# Altium schematic sheet Segway_Charging_Board_SheetName.SchDoc: Segway Charging Board
size A3; ENG_APP_DATE: --/--/--; DSN_APP_DATE: --/--/--; CHK_APP_DATE: --/--/--; SheetNumber: 1; SheetTotal: 3
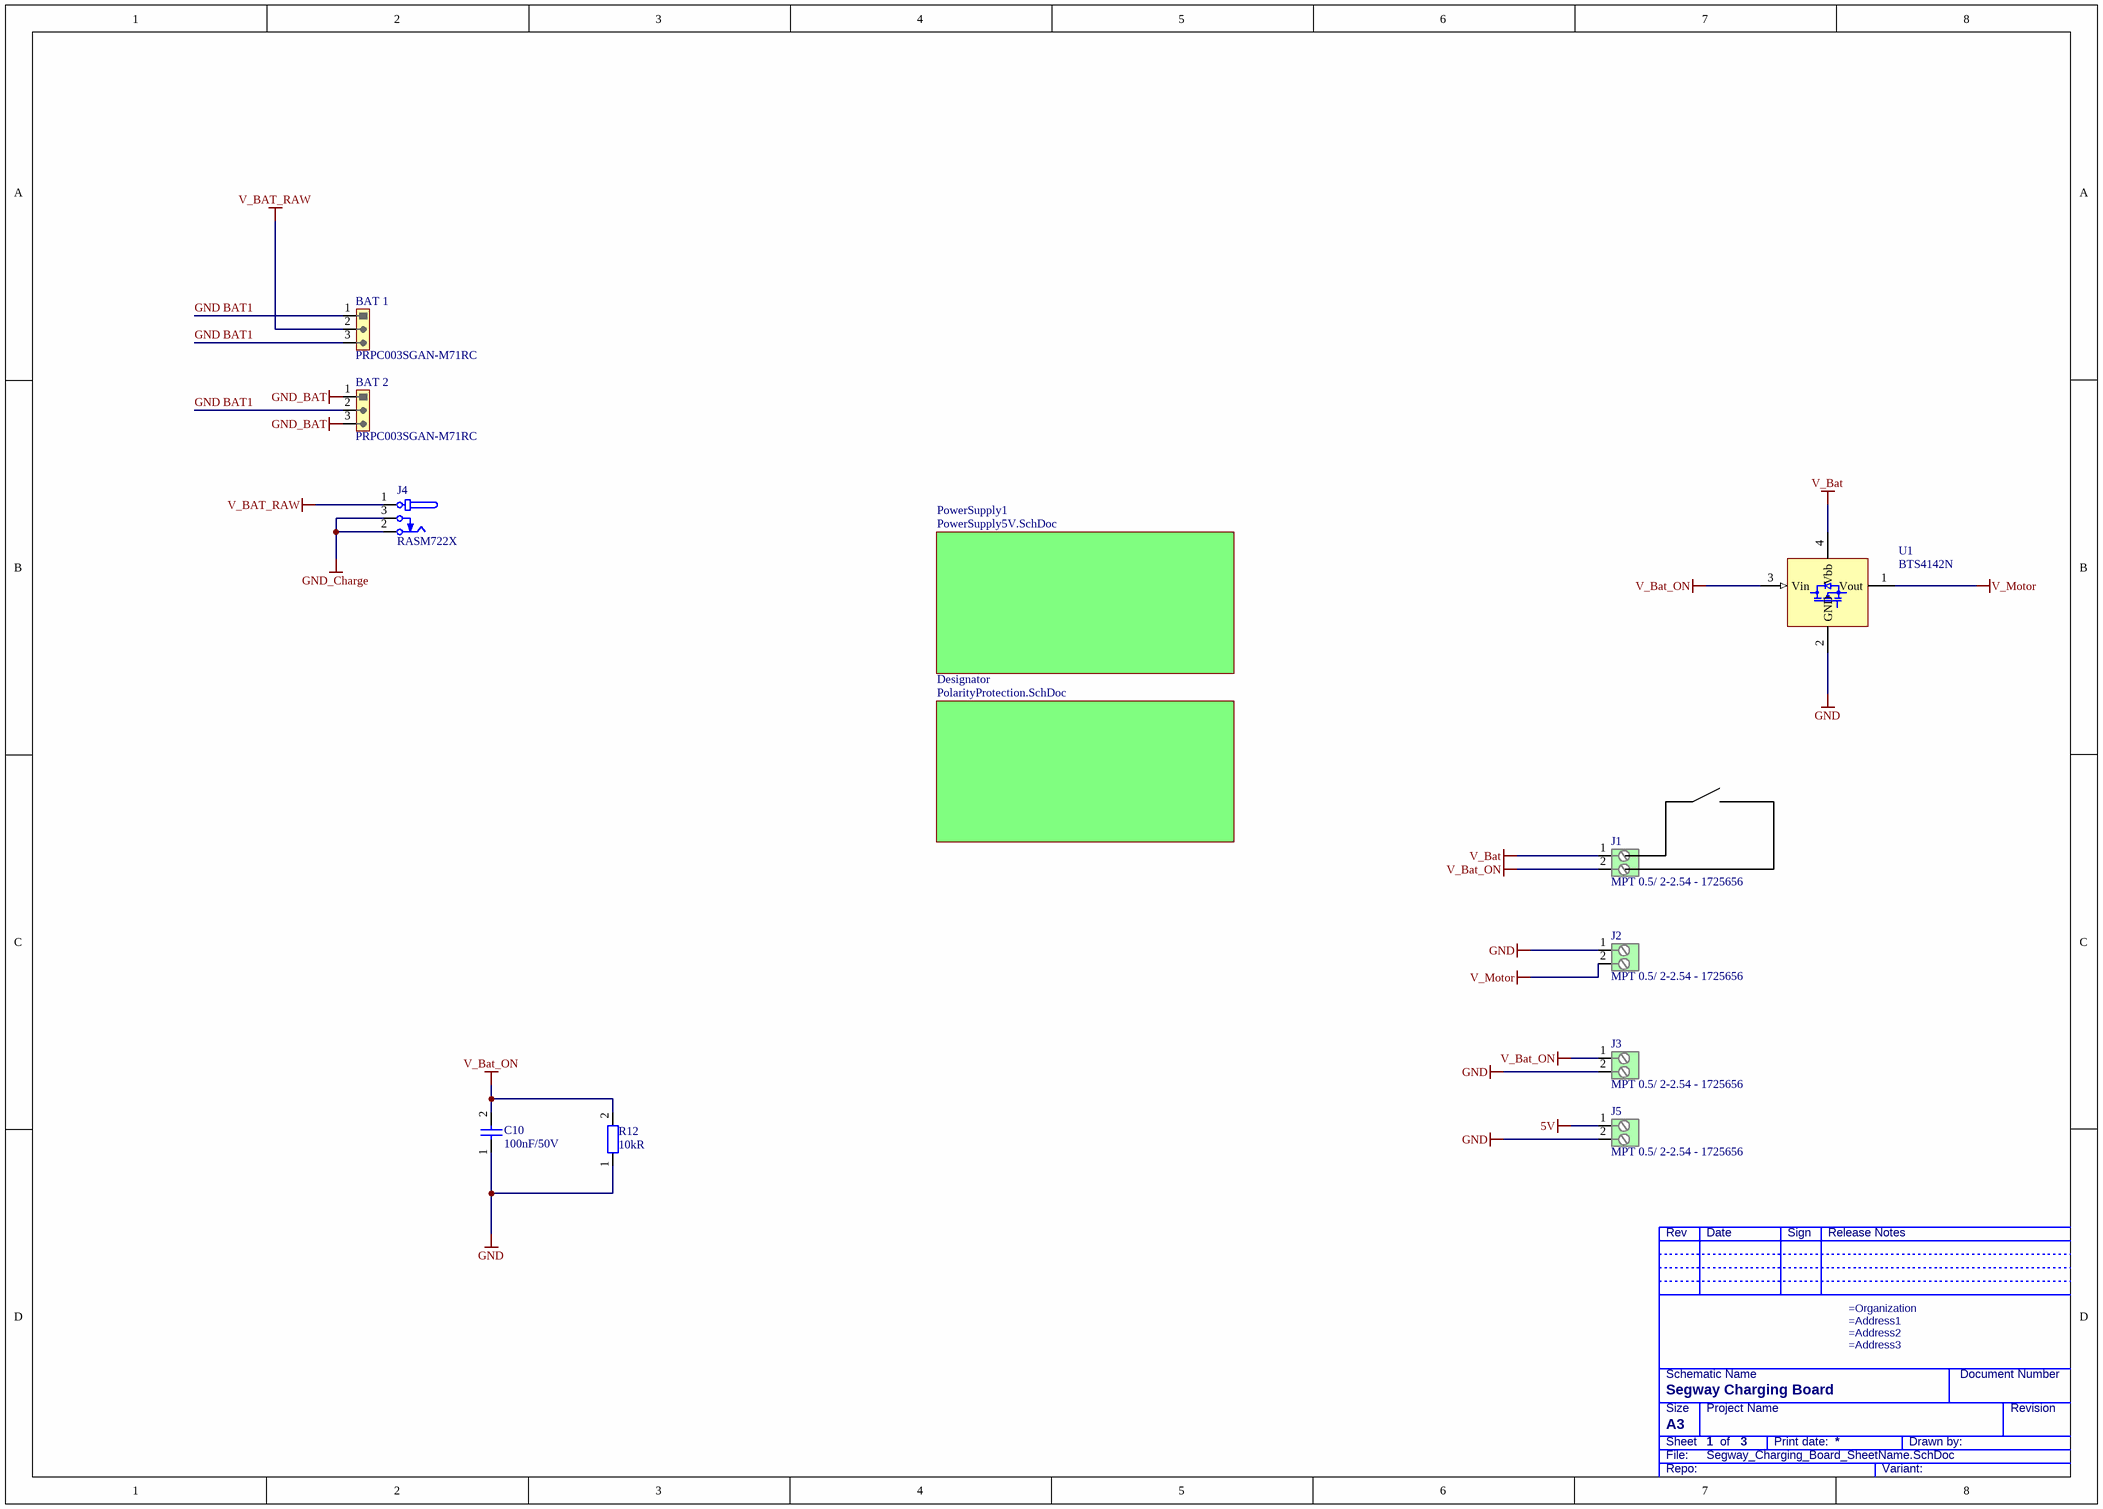
[diagram p0: Segway_Charging_Board_SheetName.SchDoc]

## Parts
BAT_1  PRPC003SGAN-M71RC  [HD254_1x3_MH]
BAT_2  PRPC003SGAN-M71RC  [HD254_1x3_MH]
C10  100nF/50V  [CAPC1005X05L]
J1  MPT 0.5/ 2-2.54 - 1725656  [PHOENIX_1725656]
J2  MPT 0.5/ 2-2.54 - 1725656  [PHOENIX_1725656]
J3  MPT 0.5/ 2-2.54 - 1725656  [PHOENIX_1725656]
J4  RASM722X  [SWITCHCRAFT_RASM722X]
J5  MPT 0.5/ 2-2.54 - 1725656  [PHOENIX_1725656]
R12  10kR  [RESC1005X04L]
U1  BTS4142N  [SOT230P700X180-4L]

## Sub-sheets
Designator = PolarityProtection.SchDoc: no entries
PowerSupply1 = PowerSupply5V.SchDoc: no entries

## Nets
5V: J5.1
GND: C10.1 J2.1 J3.2 J5.2 R12.1 U1.2(GND)
GND_BAT: BAT_2.1 BAT_2.3
GND_Charge: J4.2(TIP) J4.3(SHUNT)
V_Bat: J1.1 U1.4(Vbb)
V_Bat_ON: C10.2 J1.2 J3.1 R12.2 U1.3(Vin)
V_BAT_RAW: BAT_1.2 J4.1(SLEEVE)
V_Motor: J2.2 U1.1(Vout)
GND BAT1: BAT_1.1 BAT_1.3 BAT_2.2

## Notes on the sheet
- Rev
- Date
- Sign
- Release Notes
- Schematic Name
- Document Number
- File:
- Sheet
- Size
- A3
- Project Name
- of
- Print date:
- Drawn by:
- Revision
- Repo:
- Variant:

## Library data of the parts
BAT_1 BAT_2 = CMP-002-00172-18: Header, 1x3Pin, Pitch 2.54mm, Male, Horizontal, THT; Manufacturer: Sullins Connector Solutions; Mating Length: 8.08m; Pin Mapping: 1x3; Overall Contact Length: 0mm; Mounting Technology: THT; Pins: 3; Pitch Row: 2.54mm; Gender: Male; Pitch: 2.54mm; Termination Length: 3.05mm; Angle: Horizontal; Insulation Height: 2.5mm
C10 = CMP-001-00067-18: Cap MLCC, 100nF, 50V, X7R, 10%, 0402; Case/Package: 0402; Voltage Rating: 50V; Dielectricum: X7R; Mounting Technology: SMD; Type: MLCC; Tolerance: 10%; Case Code (Metric): 1005; Value: 100nF
J1-J3 J5 = CMP-070-000011-17: Wire to Board, Screw, 2 Pin, Pitch 2.54mm, 6A, 160V, Horizontal, THT, L6.2B5.54H12; Manufacturer: Phoenix; Pin Mapping: 1x2; Type: Wire to Board; Connection: Screw; Max Voltage: 160V; Pins: 2; Pitch: 2.54mm; Max Current: 6A; Mounting Technology: THT; Angle: Horizontal; Family Name: MPT; Size: L6.2B5.54H12
J4 = CMP-002-00013-23: Barrel Power Jack, 3 Pin, Male, 5A, 250V, Horizontal, SMD, L14.4B9H11, Diameter 2.0/5.5mm; Mating Part: S760; Manufacturer: Switchcraft; Pin Mapping: 2+1; Pitch: 0mm; Connection: Pluggable; Size: L14.5B9H11; Mounting Technology: SMD; Type: Jack; Angle: Horizontal; Max Voltage: 250V; Pins: 3; Gender: Male; Max Current: 5A
R12 = CMP-009-00149-32: Res, 10kR, 1%, 0.1W, 0402; Power: 100mW; Value: 10k; Voltage Rating: 50V; Case/Package: 0402; Type: Fixed; Mounting Technology: SMD; Case Code (Metric): 1005; Tolerance: 1%
U1 = CMP-013-00047-18: High-Side Switch, 1 Ch, 12..45V, 1.4A, SOT-223-4; Max Power Voltage: 45V; Min Power Voltage: 12V; Channels: 1; Max Current: 1.4A; Function: High-Side Switch; Mounting Technology: SMD; Max Logic Voltage: 45V; Case/Package: SOT-223-4; Min Logic Voltage: 12V